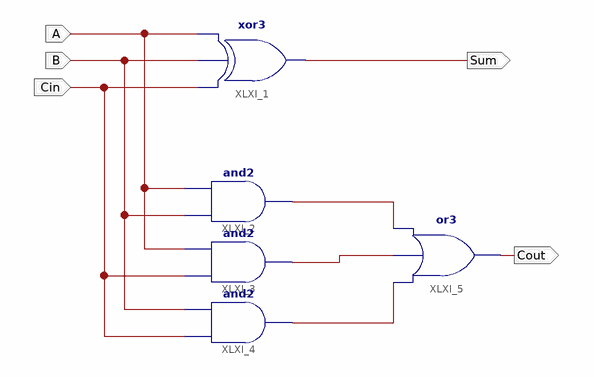
[diagram p0: schematic sheet 1]
// Xilinx ISE schematic FullAdder.sch (artix7) as structural Verilog: 5 symbols, 5 ports
module FullAdder (
  input  A,
  input  B,
  input  Cin,
  output Sum,
  output Cout
);

  wire XLXN_5, XLXN_6, XLXN_7;

  xor XLXI_1 (Sum, Cin, B, A);
  and XLXI_2 (XLXN_5, B, A);
  and XLXI_3 (XLXN_6, Cin, A);
  and XLXI_4 (XLXN_7, Cin, B);
  or XLXI_5 (Cout, XLXN_7, XLXN_6, XLXN_5);
endmodule
